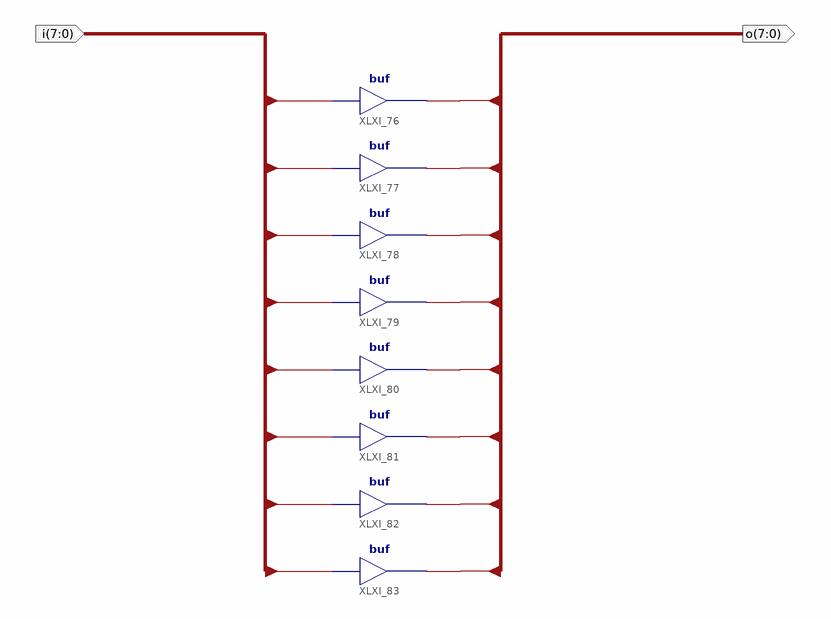
[diagram p0: schematic sheet 1]
// Xilinx ISE schematic buf_8bit.sch (aspartan6) as structural Verilog: 8 symbols, 2 ports
module buf_8bit (
  input  [7:0] i,
  output [7:0] o
);

  buf XLXI_76 (o[0], i[0]);
  buf XLXI_77 (o[1], i[1]);
  buf XLXI_78 (o[2], i[2]);
  buf XLXI_79 (o[3], i[3]);
  buf XLXI_80 (o[4], i[4]);
  buf XLXI_81 (o[5], i[5]);
  buf XLXI_82 (o[6], i[6]);
  buf XLXI_83 (o[7], i[7]);
endmodule
